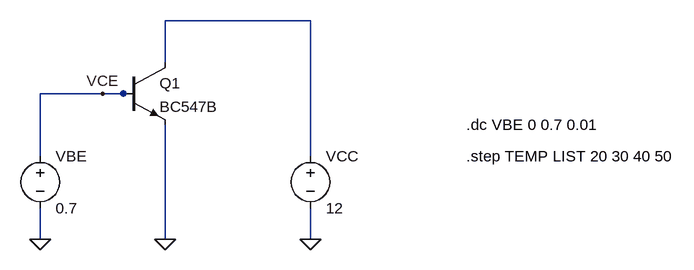
[diagram p0: schematic 3b.asc]
3b.asc, the LTspice schematic file:
Version 4
SHEET 1 1144 680
WIRE 368 112 144 112
WIRE 144 176 144 112
WIRE 48 224 -48 224
WIRE 80 224 48 224
WIRE 96 224 80 224
WIRE -48 320 -48 224
WIRE 368 320 368 112
WIRE -48 448 -48 400
WIRE 144 448 144 272
WIRE 368 448 368 400
FLAG -48 448 0
FLAG 144 448 0
FLAG 368 448 0
FLAG 48 224 VCE
SYMBOL voltage -48 304 R0
SYMATTR InstName VBE
SYMATTR Value 0.7
SYMBOL npn 80 176 R0
SYMATTR InstName Q1
SYMATTR Value BC547B
SYMBOL voltage 368 304 R0
SYMATTR InstName VCC
SYMATTR Value 12
TEXT 608 272 Left 2 !.dc VBE 0 0.7 0.01
TEXT 608 320 Left 2 !.step TEMP LIST 20 30 40 50

The netlist it stands for:
* 3b.asc
VBE VCE 0 0.7
Q1 N001 VCE 0 0 BC547B
VCC N001 0 12
.model NPN NPN
.model PNP PNP
.lib standard.bjt
.dc VBE 0 0.7 0.01
.step TEMP LIST 20 30 40 50
.backanno
.end